# Altium project BauhallenUhr_Speaker.PrjPcb
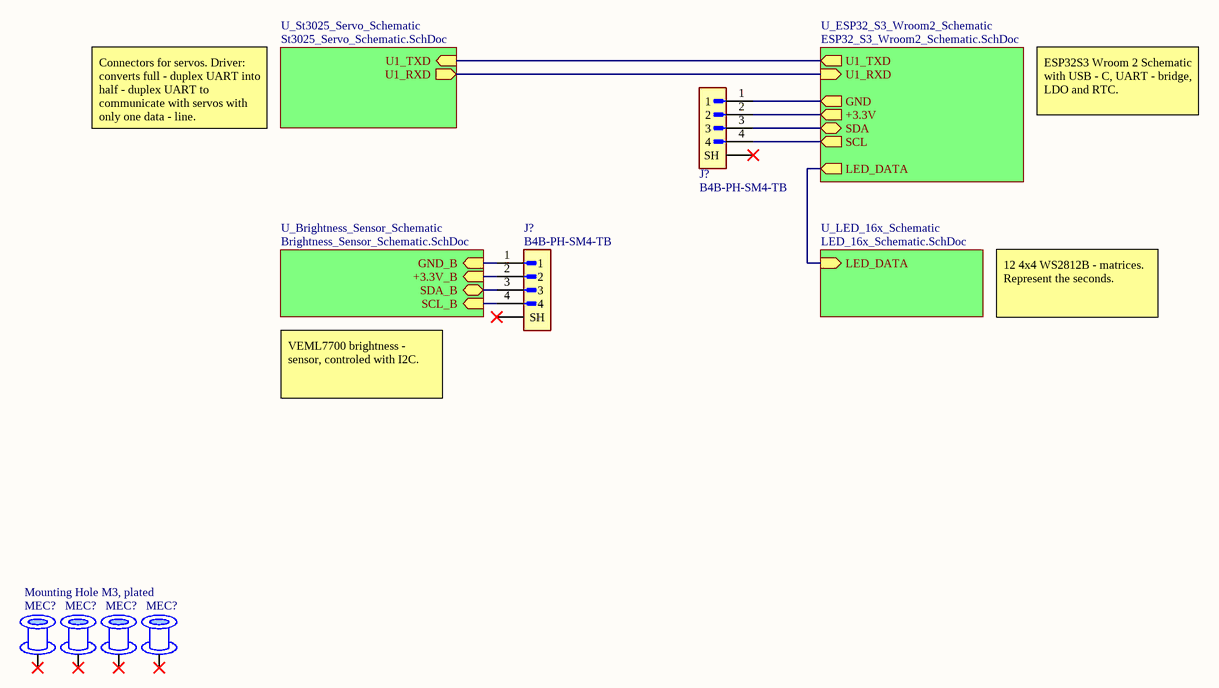
[diagram p0: Blackbox_BauhallenUhr_Schematic.SchDoc]
Author: Manuel Hueppi; Departement: DBAUG; Institut: IBK; Revision: V0.1
4 sheets, 45 parts. Net scope: hierarchical (ports join the sheet entries above them; power ports are global).
Board file: BauhallenUhr_Speaker.PcbDoc
Sheets:
  Blackbox_BauhallenUhr_Schematic.SchDoc
    U_St3025_Servo_Schematic = St3025_Servo_Schematic.SchDoc
    U_LED_16x_Schematic = LED_16x_Schematic.SchDoc
    U_Brightness_Sensor_Schematic = Brightness_Sensor_Schematic.SchDoc

## Sheet Blackbox_BauhallenUhr_Schematic.SchDoc
size A4; DocumentNumber: 1; SheetNumber: 1; SheetTotal: 5

### Parts
(Parts that share a designator on the sheet are numbered #1, #2 ... from top to bottom, then left to right.)
J?#1  B4B-PH-SM4-TB  [Connector_SMD]
J?#2  B4B-PH-SM4-TB  [Connector_SMD]
MEC?#1  Mounting Hole M3, plated  [Mounting Hole M3, plated]
MEC?#2  Mounting Hole M3, plated  [Mounting Hole M3, plated]  (value not drawn)
MEC?#3  Mounting Hole M3, plated  [Mounting Hole M3, plated]  (value not drawn)
MEC?#4  Mounting Hole M3, plated  [Mounting Hole M3, plated]  (value not drawn)

### Sub-sheets
U_Brightness_Sensor_Schematic = Brightness_Sensor_Schematic.SchDoc: SCL_B (in), SDA_B (bidir), GND_B (in), +3.3V_B (in)
U_ESP32_S3_Wroom2_Schematic = ESP32_S3_Wroom2_Schematic.SchDoc (file not in this document): U1_TXD (out), U1_RXD (in), LED_DATA (out), SCL (out), SDA (bidir), +3.3V (out), GND (out)
U_LED_16x_Schematic = LED_16x_Schematic.SchDoc: LED_DATA (in)
U_St3025_Servo_Schematic = St3025_Servo_Schematic.SchDoc: U1_TXD (in), U1_RXD (out)

### Nets
+3.3V_B: J?#2.2 ; sheet U_Brightness_Sensor_Schematic/+3.3V_B
GND_B: J?#2.1 ; sheet U_Brightness_Sensor_Schematic/GND_B
SCL_B: J?#2.4 ; sheet U_Brightness_Sensor_Schematic/SCL_B
SDA_B: J?#2.3 ; sheet U_Brightness_Sensor_Schematic/SDA_B
SERVO_TXD: sheet U_St3025_Servo_Schematic/U1_TXD, sheet U_ESP32_S3_Wroom2_Schematic/U1_TXD
NetJ?#1_1: J?#1.1 ; sheet U_ESP32_S3_Wroom2_Schematic/GND
NetJ?#1_2: J?#1.2 ; sheet U_ESP32_S3_Wroom2_Schematic/+3.3V
NetJ?#1_3: J?#1.3 ; sheet U_ESP32_S3_Wroom2_Schematic/SDA
NetJ?#1_4: J?#1.4 ; sheet U_ESP32_S3_Wroom2_Schematic/SCL
NetJ?#1_SH1: J?#1.SH1(SH) J?#1.SH2(SHIELD)
NetJ?#2_SH1: J?#2.SH1(SH) J?#2.SH2(SHIELD)
NetR?#3_1: sheet U_St3025_Servo_Schematic/U1_RXD, sheet U_ESP32_S3_Wroom2_Schematic/U1_RXD

Not connected (* = marked no-connect by the designer): MEC?#1 1*; MEC?#2 1*; MEC?#3 1*; MEC?#4 1*

### Buses and harness runs
bus sheet U_ESP32_S3_Wroom2_Schematic/LED_DATA = sheet U_LED_16x_Schematic/LED_DATA

### Notes on the sheet
- Connectors for servos. Driver: converts full - duplex UART into half - duplex UART to communicate with servos with only one data - line.
- ESP32S3 Wroom 2 Schematic with USB - C, UART - bridge, LDO and RTC.
- 12 4x4 WS2812B - matrices. Represent the seconds.
- VEML7700 brightness - sensor, controled with I2C.
- Date:
- Title of drawing:
- Time:
- Drawn by:
- Project:
- Revision:
- Institut:
- Departement:
- Page:
- from:
- File:

### Library data of the parts
J?#1 J?#2 = Connector_SMD_Small_Symbol: CONN HEADER SMD 4POS 2MM.; ComponentLink1Description: Supplier; ComponentLink1URL: https://www.digikey.ch/en/products/detail/jst-sales-america-inc/B4B-PH-SM4-TB/926643
MEC?#1-MEC?#4 = Mounting Hole M3, plated: Mounting Hole for M3 Screw, plated to connect signal

## Sheet St3025_Servo_Schematic.SchDoc
size A4; DocumentNumber: 3; SheetNumber: 3; SheetTotal: 5
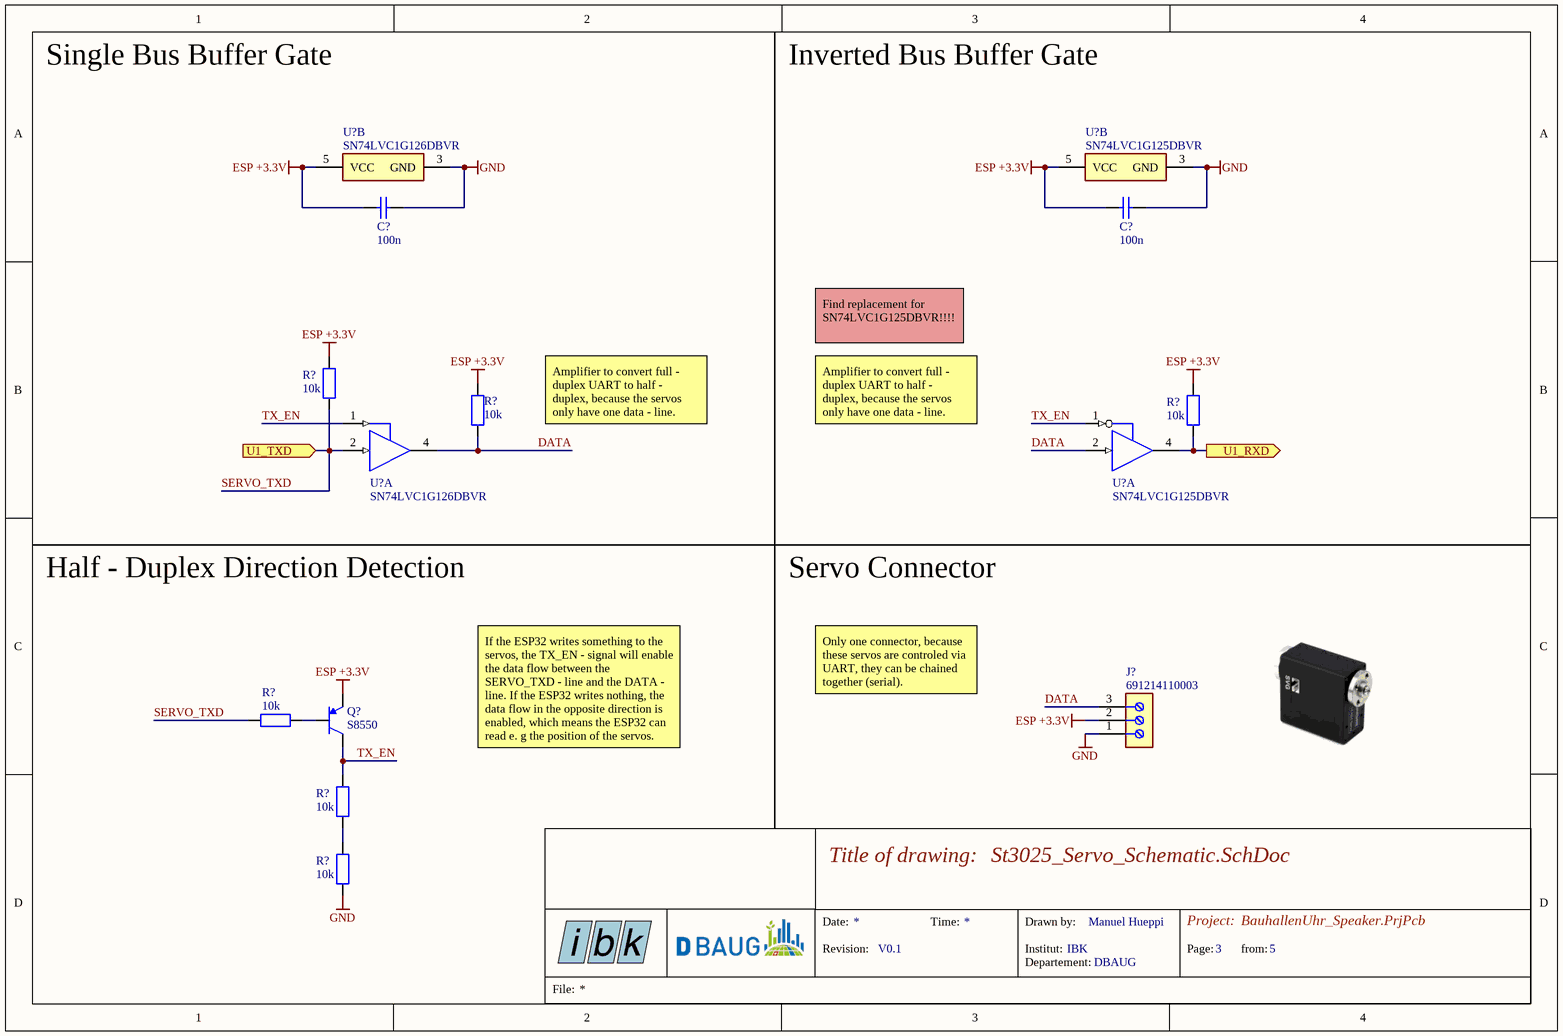
[diagram p1: St3025_Servo_Schematic.SchDoc]

### Parts
(Parts that share a designator on the sheet are numbered #1, #2 ... from top to bottom, then left to right.)
C?#1  100n  [0603_CAPACITOR]
C?#2  100n  [0603_CAPACITOR]
J?#3  691214110003  [Screw_Connector]
Q?#1  S8550  [PNP_Bipolar_Transistor]
R?#1  10k  [0603_Resistor]
R?#2  10k  [0603_Resistor]
R?#3  10k  [0603_Resistor]
R?#4  10k  [0603_Resistor]
R?#5  10k  [0603_Resistor]
R?#6  10k  [0603_Resistor]
U?#1  SN74LVC1G126DBVR  [DBV0005A_L_Single_Bus_Buffer_Gate]  (part B of 2)
U?#2  SN74LVC1G125DBVR  [DBV0005A_L_Single_Bus_Buffer_Gate]  (part B of 2)
U?#3  SN74LVC1G126DBVR  [DBV0005A_L_Single_Bus_Buffer_Gate]  (part A of 2)
U?#4  SN74LVC1G125DBVR  [DBV0005A_L_Single_Bus_Buffer_Gate]  (part A of 2)

### Ports
U1_RXD (out), U1_TXD (in)

### Nets
ESP +3.3V: C?#1.2 C?#2.2 J?#3.2 Q?#1.2(E) R?#1.2 R?#2.2 R?#3.2 U?#1.5(VCC) U?#2.5(VCC)
GND: C?#1.1 C?#2.1 J?#3.1 R?#6.1 U?#1.3(GND) U?#2.3(GND)
DATA: J?#3.3 R?#2.1 U?#3.4(Y) U?#4.2(A)
SERVO_TXD: R?#1.1 R?#4.2 U?#3.2(A) ; port U1_TXD
TX_EN: Q?#1.3(C) R?#5.2 U?#3.1(OE) U?#4.1(OE)
NetQ?#1_1: Q?#1.1(B) R?#4.1
NetR?#3_1: R?#3.1 U?#4.4(Y) ; port U1_RXD
NetR?#5_1: R?#5.1 R?#6.2

### Notes on the sheet
- Single Bus Buffer Gate
- Inverted Bus Buffer Gate
- Find replacement for SN74LVC1G125DBVR!!!!
- Amplifier to convert full - duplex UART to half - duplex, because the servos only have one data - line.
- Half - Duplex Direction Detection
- Servo Connector
- Only one connector, because these servos are controled via UART, they can be chained together (serial).
- If the ESP32 writes something to the servos, the TX_EN - signal will enable the data flow between the SERVO_TXD - line and the DATA - line. If the ESP32 writes nothing, the data flow in the opposite direction is enabled, which means the ESP32 can read e. g the position of the servos.
- Date:
- Title of drawing:
- Time:
- Drawn by:
- Project:
- Revision:
- Institut:
- Departement:
- Page:
- from:
- File:

### Library data of the parts
C?#1 C?#2 = Capacitor: 0603
J?#3 = Screw_Connector: 691214110003 Wurth Elektronik
Q?#1 = PNP_Bipolar_Transistor: Bipolar (BJT) Transistor PNP 25 V 500 mA 150MHz 300 mW Surface Mount SOT-23.
R?#1-R?#6 = Resistor: 0603
U?#1 U?#3 = Single_Bus_Buffer_Gate: Single Bus Buffer Gate With 3-State Outputs, DBV0005A, LARGE T&R.; ComponentLink1Description: Supplier; ComponentLink1URL: https://www.digikey.com/en/products/detail/texas-instruments/SN74LVC1G126DBVR/385722
U?#2 U?#4 = Single_Bus_Buffer_Gate_Inverted: Single Bus Buffer Gate With 3-State Outputs, DBV0005A, LARGE T&R.; ComponentLink1Description: Supplier; ComponentLink1URL: *

## Sheet LED_16x_Schematic.SchDoc
size A4; DocumentNumber: 4; SheetNumber: 4; SheetTotal: 5
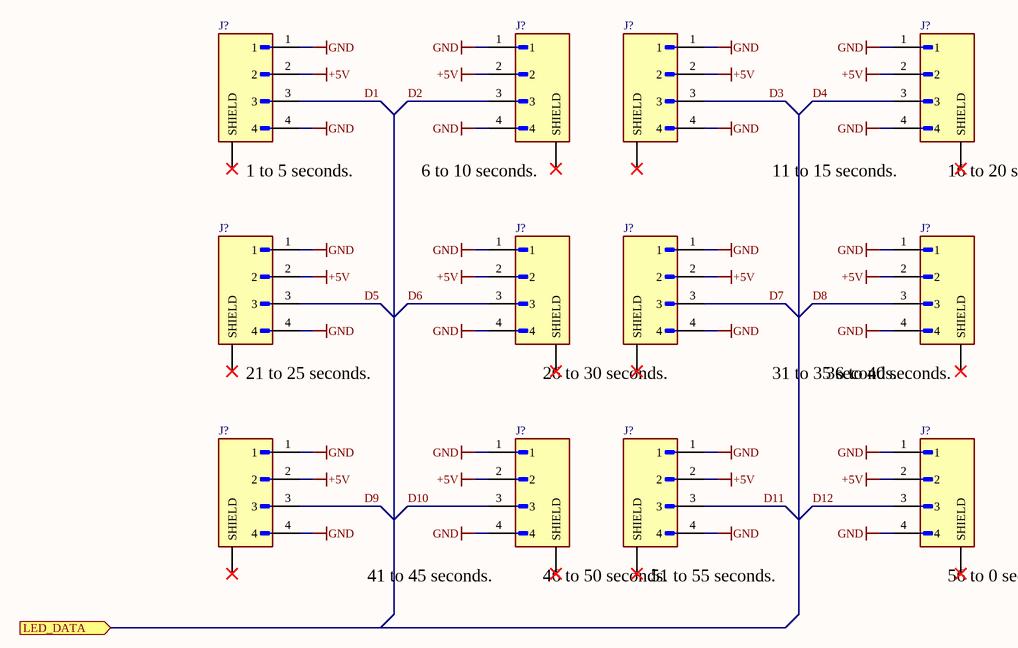
[diagram p2: LED_16x_Schematic.SchDoc]

### Parts
(Parts that share a designator on the sheet are numbered #1, #2 ... from top to bottom, then left to right.)
J?#4  B4B-PH-SM4-TB  [Connector_SMD]  (value not drawn)
J?#5  B4B-PH-SM4-TB  [Connector_SMD]  (value not drawn)
J?#6  B4B-PH-SM4-TB  [Connector_SMD]  (value not drawn)
J?#7  B4B-PH-SM4-TB  [Connector_SMD]  (value not drawn)
J?#8  B4B-PH-SM4-TB  [Connector_SMD]  (value not drawn)
J?#9  B4B-PH-SM4-TB  [Connector_SMD]  (value not drawn)
J?#10  B4B-PH-SM4-TB  [Connector_SMD]  (value not drawn)
J?#11  B4B-PH-SM4-TB  [Connector_SMD]  (value not drawn)
J?#12  B4B-PH-SM4-TB  [Connector_SMD]  (value not drawn)
J?#13  B4B-PH-SM4-TB  [Connector_SMD]  (value not drawn)
J?#14  B4B-PH-SM4-TB  [Connector_SMD]  (value not drawn)
J?#15  B4B-PH-SM4-TB  [Connector_SMD]  (value not drawn)

### Ports
LED_DATA (in)

### Nets
+5V: J?#4.2 J?#5.2 J?#6.2 J?#7.2 J?#8.2 J?#9.2 J?#10.2 J?#11.2 J?#12.2 J?#13.2 J?#14.2 J?#15.2
GND: J?#4.1 J?#4.4 J?#5.1 J?#5.4 J?#6.1 J?#6.4 J?#7.1 J?#7.4 J?#8.1 J?#8.4 J?#9.1 J?#9.4 J?#10.1 J?#10.4 J?#11.1 J?#11.4 J?#12.1 J?#12.4 J?#13.1 J?#13.4 J?#14.1 J?#14.4 J?#15.1 J?#15.4
D1: J?#4.3
D2: J?#6.3
D3: J?#5.3
D4: J?#7.3
D5: J?#8.3
D6: J?#10.3
D7: J?#9.3
D8: J?#11.3
D9: J?#12.3
D10: J?#14.3
D11: J?#13.3
D12: J?#15.3
NetJ?#4_SH1: J?#4.SH1(SHIELD) J?#4.SH2(SHIELD)
NetJ?#5_SH1: J?#5.SH1(SHIELD) J?#5.SH2(SHIELD)
NetJ?#6_SH1: J?#6.SH1(SHIELD) J?#6.SH2(SHIELD)
NetJ?#7_SH1: J?#7.SH1(SHIELD) J?#7.SH2(SHIELD)
NetJ?#8_SH1: J?#8.SH1(SHIELD) J?#8.SH2(SHIELD)
NetJ?#9_SH1: J?#9.SH1(SHIELD) J?#9.SH2(SHIELD)
NetJ?#10_SH1: J?#10.SH1(SHIELD) J?#10.SH2(SHIELD)
NetJ?#11_SH1: J?#11.SH1(SHIELD) J?#11.SH2(SHIELD)
NetJ?#12_SH1: J?#12.SH1(SHIELD) J?#12.SH2(SHIELD)
NetJ?#13_SH1: J?#13.SH1(SHIELD) J?#13.SH2(SHIELD)
NetJ?#14_SH1: J?#14.SH1(SHIELD) J?#14.SH2(SHIELD)
NetJ?#15_SH1: J?#15.SH1(SHIELD) J?#15.SH2(SHIELD)

### Notes on the sheet
- (near J?#4) 1 to 5 seconds.
- (near J?#6) 6 to 10 seconds.
- (near J?#5) 11 to 15 seconds.
- (near J?#7) 16 to 20 seconds.
- (near J?#8) 21 to 25 seconds.
- (near J?#10) 26 to 30 seconds.
- (near J?#9) 31 to 35 seconds.
- (near J?#11) 36 to 40 seconds.
- (near J?#12) 41 to 45 seconds.
- (near J?#14) 46 to 50 seconds.
- (near J?#13) 51 to 55 seconds.
- (near J?#15) 56 to 0 seconds.
- Date:
- Title of drawing:
- Time:
- Drawn by:
- Project:
- Revision:
- Institut:
- Departement:
- Page:
- from:
- File:

### Library data of the parts
J?#4-J?#15 = Connector_SMD: CONN HEADER SMD 4POS 2MM.; ComponentLink1Description: Supplier; ComponentLink1URL: https://www.digikey.ch/en/products/detail/jst-sales-america-inc/B4B-PH-SM4-TB/926643

## Sheet Brightness_Sensor_Schematic.SchDoc
size A4; DocumentNumber: 5; SheetNumber: 5; SheetTotal: 5
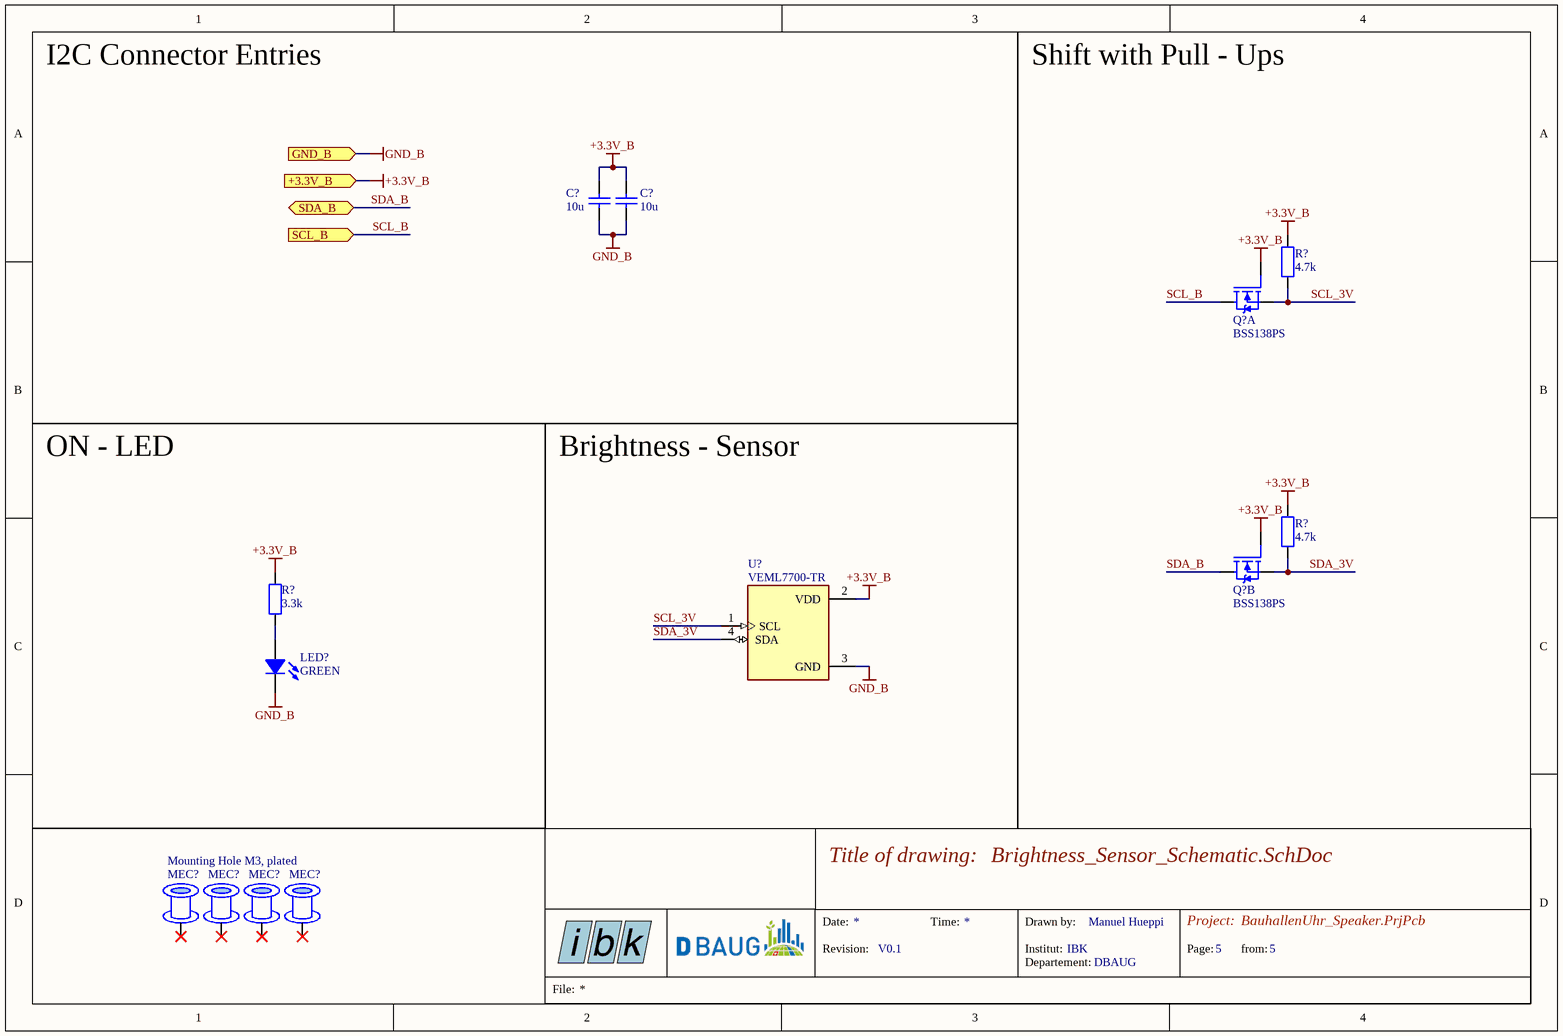
[diagram p3: Brightness_Sensor_Schematic.SchDoc]

### Parts
(Parts that share a designator on the sheet are numbered #1, #2 ... from top to bottom, then left to right.)
C?#3  10u  [0603_CAPACITOR]
C?#4  10u  [0603_CAPACITOR]
LED?  GREEN  [LED_0603, GREEN]
MEC?#5  Mounting Hole M3, plated  [Mounting Hole M3, plated]
MEC?#6  Mounting Hole M3, plated  [Mounting Hole M3, plated]  (value not drawn)
MEC?#7  Mounting Hole M3, plated  [Mounting Hole M3, plated]  (value not drawn)
MEC?#8  Mounting Hole M3, plated  [Mounting Hole M3, plated]  (value not drawn)
Q?#2  BSS138PS  [Dual_N_Channel_MOS_FET]  (part A of 2)
Q?#3  BSS138PS  [Dual_N_Channel_MOS_FET]  (part B of 2)
R?#7  4.7k  [0603_Resistor]
R?#8  4.7k  [0603_Resistor]
R?#9  3.3k  [0603_Resistor]
U?#5  VEML7700-TR  [Brightness_Sensor]

### Ports
+3.3V_B (in), GND_B (in), SCL_B (in), SDA_B (bidir)

### Nets
+3.3V_B: C?#3.2 C?#4.2 Q?#2.2(G) Q?#3.2(G) R?#7.2 R?#8.2 R?#9.2 U?#5.2(VDD) ; port +3.3V_B
GND_B: C?#3.1 C?#4.1 LED?.K U?#5.3(GND) ; port GND_B
SCL_3V: Q?#2.1(S) R?#7.1 U?#5.1(SCL)
SCL_B: Q?#2.6(D) ; port SCL_B
SDA_3V: Q?#3.1(S) R?#8.1 U?#5.4(SDA)
SDA_B: Q?#3.6(D) ; port SDA_B
NetLED?_A: LED?.A R?#9.1

Not connected (* = marked no-connect by the designer): MEC?#5 1*; MEC?#6 1*; MEC?#7 1*; MEC?#8 1*

### Notes on the sheet
- I2C Connector Entries
- Shift with Pull - Ups
- ON - LED
- Brightness - Sensor
- Date:
- Title of drawing:
- Time:
- Drawn by:
- Project:
- Revision:
- Institut:
- Departement:
- Page:
- from:
- File:

### Library data of the parts
C?#3 C?#4 = Capacitor: 0603
LED? = LED_0603, GREEN: LED 0603, Green, 3.2 V, 20 mA, 430 mcd
MEC?#5-MEC?#8 = Mounting Hole M3, plated: as MEC?#1 on sheet Blackbox_BauhallenUhr_Schematic
Q?#2 Q?#3 = Dual_N_Channel_MOS_FET: Mosfet Array 60V 300mA (Ta) 350mW (Ta) Surface Mount SOT-23-6.; ComponentLink1Description: Supplier; ComponentLink1URL: https://www.digikey.ch/en/products/detail/nexperia-usa-inc/2N7002PS-115/2296325?s=N4IgTCBcDaIKwDYAcBaOBOJAWFBGFAcgCIgC6AvkA
R?#7-R?#9 = Resistor: 0603
U?#5 = Brightness_Sensor: SENSOR OPT 545NMAMB 4 SMD J LEAD.; ComponentLink1Description: Supplier; ComponentLink1URL: https://www.digikey.ch/en/products/detail/vishay-semiconductor-opto-division/VEML7700-TR/5820243

## Nets that join several sheets
+3.3V_B: Blackbox_BauhallenUhr_Schematic (J?#2.2), Brightness_Sensor_Schematic (8 pins)
GND: St3025_Servo_Schematic (6 pins), LED_16x_Schematic (24 pins)
GND_B: Blackbox_BauhallenUhr_Schematic (J?#2.1), Brightness_Sensor_Schematic (C?#3.1 C?#4.1 LED?.K U?#5.3)
SCL_B: Blackbox_BauhallenUhr_Schematic (J?#2.4), Brightness_Sensor_Schematic (Q?#2.6)
SDA_B: Blackbox_BauhallenUhr_Schematic (J?#2.3), Brightness_Sensor_Schematic (Q?#3.6)

## Assembly variants
Standard-Variant: all parts fitted
All-Components: all parts fitted